# EAGLE design ATmega8U2_Breakout-v11 (EAGLE 5.10)
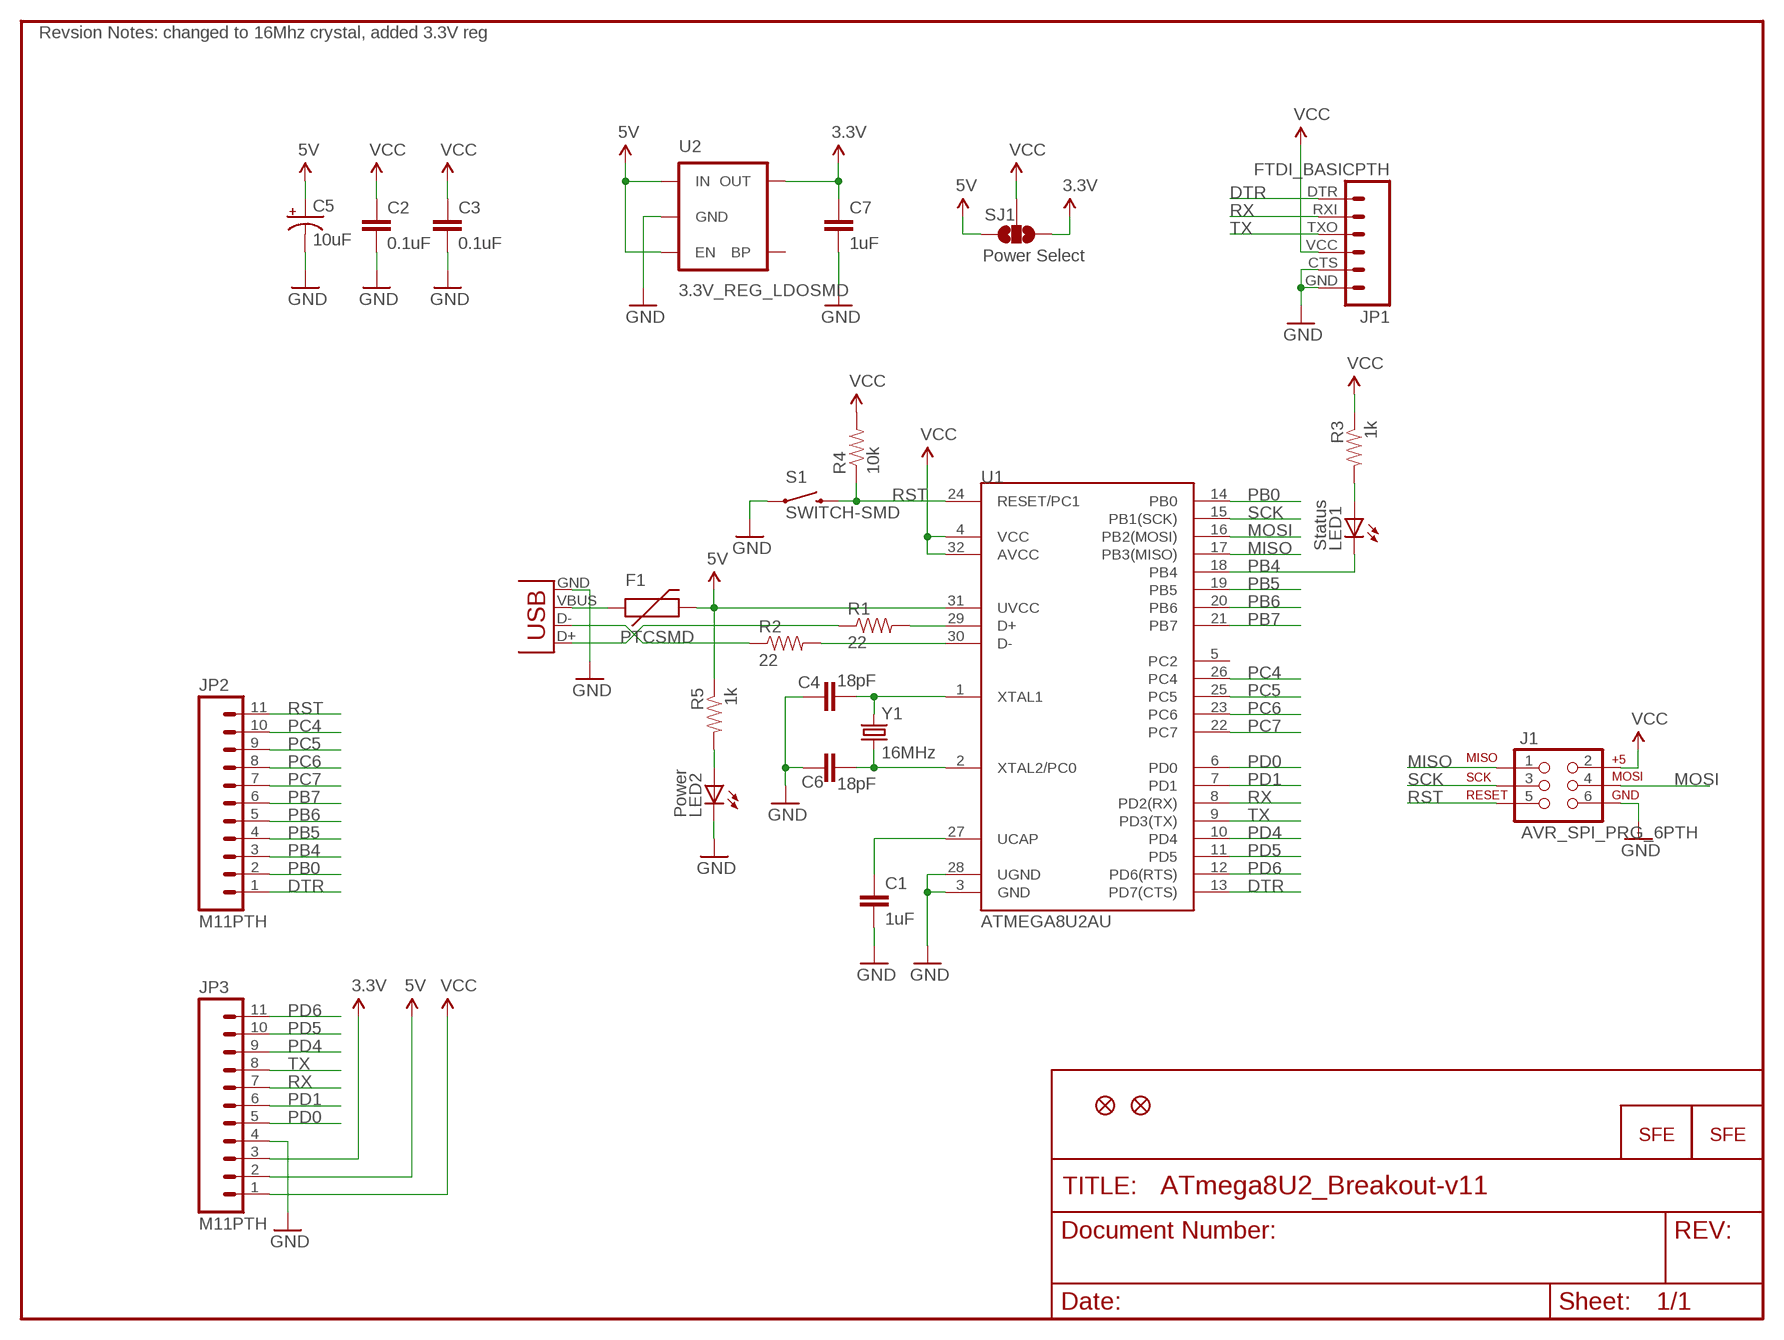
[diagram p0: schematic, sheet 1]

## Parts
C1  1uF  CAP0402-CAP  [0402-CAP]
C2  0.1uF  CAP0402-CAP  [0402-CAP]
C3  0.1uF  CAP0402-CAP  [0402-CAP]
C4  18pF  CAP0402-CAP  [0402-CAP]
C5  10uF  CAP_POL1206  [EIA3216]
C6  18pF  CAP0402-CAP  [0402-CAP]
C7  1uF  CAP0402-CAP  [0402-CAP]
F1  PTCSMD  [PTC-1206]
J1  AVR_SPI_PRG_6PTH  [2X3]
JP1  FTDI_BASICPTH  [FTDI_BASIC]
JP2  M11PTH  [1X11]
JP3  M11PTH  [1X11]
JP4  LOGO-SFENEW  [SFE-NEW-WEBLOGO]
JP5  LOGO-SFESK  [SFE-LOGO-FLAME]
JP6  FIDUCIAL1X2  [FIDUCIAL-1X2]
JP7  FIDUCIAL1X2  [FIDUCIAL-1X2]
LED1  Status  LED0603  [LED-0603]
LED2  Power  LED0603  [LED-0603]
R1  22  RESISTOR0402-RES  [0402-RES]
R2  22  RESISTOR0402-RES  [0402-RES]
R3  1k  RESISTOR0402-RES  [0402-RES]
R4  10k  RESISTOR0402-RES  [0402-RES]
R5  1k  RESISTOR0402-RES  [0402-RES]
S1  SWITCH-SMD  SWITCH-MOMENTARY-2SMD  [TACTILE_SWITCH_SMD]
SJ1  Power Select  SOLDERJUMPER_2WAYPASTE2&3  [SJ_3_PASTE2&3]
U1  ATMEGA8U2AU  [TQFP32-08]
U2  3.3V_REG_LDOSMD  V_REG_LDOSMD  [SOT23-5]
X1  USBSMD  [USB-MINIB]
Y1  16MHz  CRYSTAL5X3  [CRYSTAL-SMD-5X3]

## Nets
3.3V: C7.1 JP3.3 SJ1.1 U2.5(OUT)
5V: C5.A(+) F1.2 JP3.2 R5.1 SJ1.3 U1.31(UVCC) U2.1(IN) U2.3(EN)
DTR: JP1.DTR JP2.1 U1.13(PD7(CTS))
GND: C1.2 C2.2 C3.2 C4.2 C5.C(-) C6.2 C7.2 J1.6 JP1.CTS JP1.GND JP3.4 LED2.C S1.1 U1.3(GND) U1.28(UGND) U2.2(GND) X1.GND
MISO: J1.1 U1.17(PB3(MISO))
MOSI: J1.4 U1.16(PB2(MOSI))
N$1: F1.1 X1.VBUS
N$2: LED2.A R5.2
N$3: R1.2 U1.29(D+)
N$4: R2.2 U1.30(D-)
N$5: R1.1 X1.D+
N$6: R2.1 X1.D-
N$7: LED1.A R3.2
N$8: C4.1 U1.1(XTAL1) Y1.3
N$9: C6.1 U1.2(XTAL2/PC0) Y1.1
N$12: C1.1 U1.27(UCAP)
PB0: JP2.2 U1.14(PB0)
PB4: JP2.3 LED1.C U1.18(PB4)
PB5: JP2.4 U1.19(PB5)
PB6: JP2.5 U1.20(PB6)
PB7: JP2.6 U1.21(PB7)
PC4: JP2.10 U1.26(PC4)
PC5: JP2.9 U1.25(PC5)
PC6: JP2.8 U1.23(PC6)
PC7: JP2.7 U1.22(PC7)
PD0: JP3.5 U1.6(PD0)
PD1: JP3.6 U1.7(PD1)
PD4: JP3.9 U1.10(PD4)
PD5: JP3.10 U1.11(PD5)
PD6: JP3.11 U1.12(PD6(RTS))
RST: J1.5 JP2.11 R4.1 S1.3 U1.24(RESET/PC1)
RX: JP1.RXI JP3.7 U1.8(PD2(RX))
SCK: J1.3 U1.15(PB1(SCK))
TX: JP1.TXO JP3.8 U1.9(PD3(TX))
VCC: C2.1 C3.1 J1.2 JP1.VCC JP3.1 R3.1 R4.2 SJ1.2 U1.4(VCC) U1.32(AVCC)
Unconnected: U1.5(PC2) U2.4(BP)

## Notes on the sheet
- Revsion Notes: changed to 16Mhz crystal, added 3.3V reg

## Library data of the parts
C1-C4 C6 C7 = SparkFun:CAP: Capacitor Standard 0603 ceramic capacitor, and 0.1" leaded capacitor.
C5 = SparkFun:CAP_POL: Capacitor Polarized These are standard SMD and PTH capacitors. Normally 10uF, 47uF, and 100uF in electrolytic and tantalum varieties. Always verify the external diameter of the through hole cap, it varies with capacity, voltage, and manufacturer. The EIA devices should be standard.
F1 = SparkFun:PTC: Resettable Fuse PTC Resettable Fuse. Spark Fun Electronics SKU : COM-08357
J1 = SparkFun:AVR_SPI_PRG_6: AVR ISP 6 Pin This is the reduced ISP connector for AVR programming. Common on Arduino. This footprint will take up less PCB space and can be used with a 10-pin to 6-pin adapter such as SKU: BOB-08508
JP1 = SparkFun:FTDI_BASIC: FTDI Basic: 3.3V and 5V
JP2 JP3 = SparkFun:M11: Header 11 Standard 11-pin 0.1" header. Use with straight break away headers (SKU : PRT-00116), right angle break away headers (PRT-00553), swiss pins (PRT-00743), machine pins (PRT-00117), and female headers (PRT-00115).
JP4 JP5 = SparkFun:LOGO-SFE: Spark Fun Electronics PCB Logo This is the standard Spark Fun Electronics PCB logo.
JP6 JP7 = SparkFun:FIDUCIAL: Fiducial Alignment Points Various fiducial points for machine vision alignment.
LED1 LED2 = SparkFun:LED: LEDs Standard schematic elements and footprints for 5mm, 3mm, 1206, and 0603 sized LEDs. 5mm - Spark Fun Electronics SKU : COM-00529 (and others)
R1-R5 = SparkFun:RESISTOR: Resistor Basic schematic elements and footprints for 0603, 1206, and PTH resistors.
S1 = SparkFun:SWITCH-MOMENTARY-2
SJ1 = SparkFun:SOLDERJUMPER_2WAY: Solder Jumper 2 way solder jumper
U1 = SparkFun:ATMEGA8U2: Atmel 8-bit Microcontroller with 8/16/32K Bystes of ISP Flash and USB Controller. ATmega8U2, ATmega16U2, and ATmega32U2
U2 = SparkFun:V_REG_LDO: Voltage Regulator LDO Standard 150mA LDO voltage regulator in SOT-23 layout. Micrel part MIC5205. BP (by-pass) pin is used to lower output noise with 470pF cap.
X1 = SparkFun:USB: USB Connectors USB-B-PTH is fully proven SKU : PRT-00139 USB-miniB is fully proven SKU : PRT-00587 USB-A-PCB is untested. USB-A-H is throughly reviewed, but untested. Spark Fun Electronics SKU : PRT-00437 USB-B-SMT is throughly reviewed, but untested. Needs silkscreen touching up. USB-A-S has not been used/tested USB-MB-H has not been used/tested
Y1 = SparkFun:CRYSTAL: Crystals Various standard crystals. Proven footprints. Spark Fun Electronics SKU : COM-00534

## Board
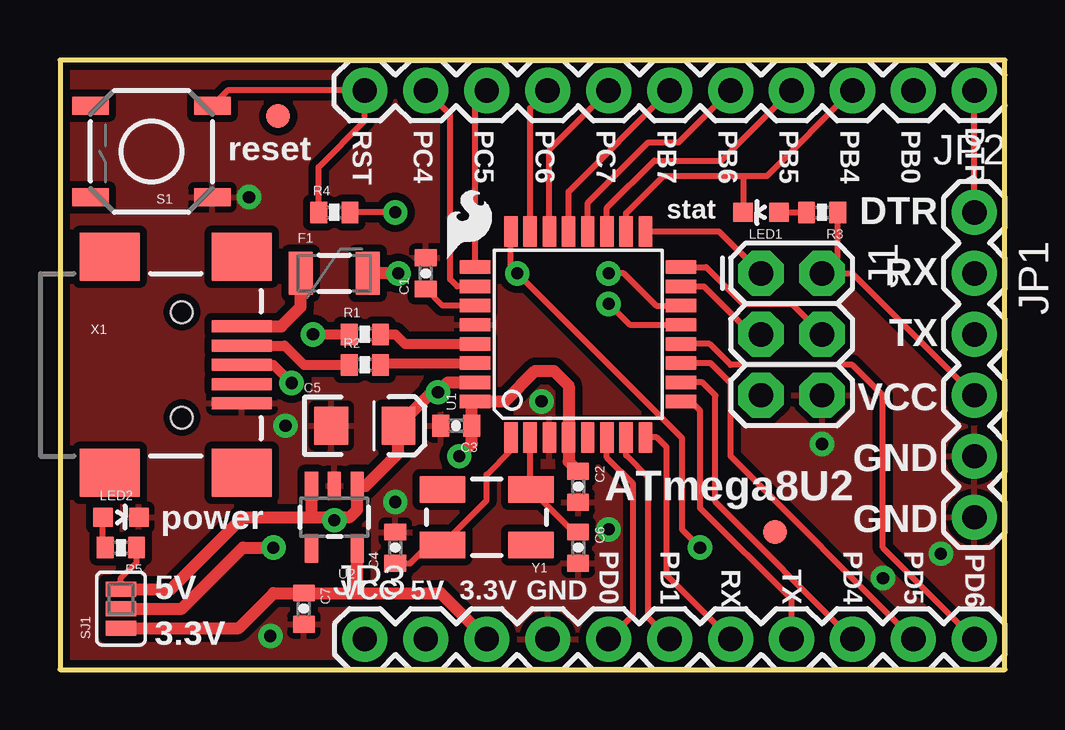
[diagram p1: board, top side]
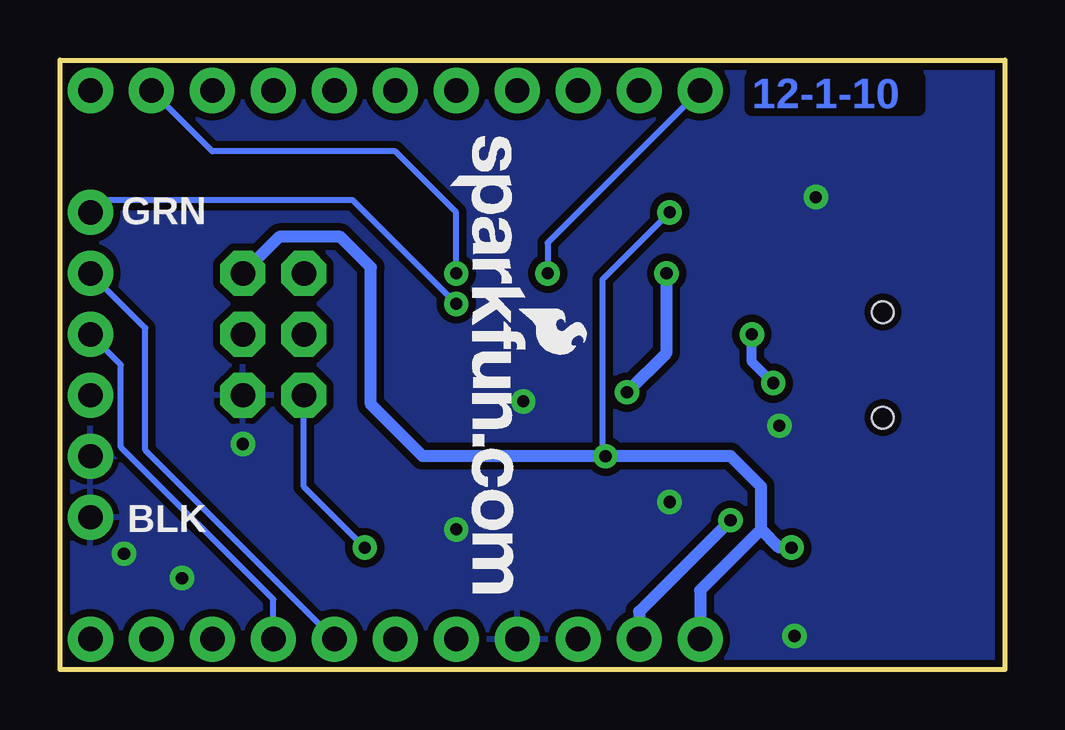
[diagram p2: board, bottom side, seen from below]

Size 39.37 x 25.4 mm. Coordinates in mm from the lower left corner, seen from the top.
Outline: 0,0 39.37,0 39.37,25.4 0,25.4 0,0
Copper layers (1*16): Top 0.035mm / dielectric 1.5mm / Bottom 0.035mm
Design rules "SparkFun": minimum track width 8mil, minimum drill 20mil, track to track 8mil, track to pad 8mil, pad to pad 8mil, via to via 8mil, smd to smd 8mil, copper to edge 8mil, drill to drill 8mil, minimum pad ring 12mil, minimum via ring 10mil, stop-mask expansion 4mil, vias tented up to drill 20mil, thermal gap 10mil

### Footprints (pad centres in the part's own frame; a part is rotated, then mirrored left to right if it is on the bottom)
0402-CAP = smd 0.7 x 0.9: 1 -0.65,0; 2 0.65,0
EIA3216 = smd 1.4 x 1.6: A 1.4,0; C -1.4,0
PTC-1206 = smd 1 x 1.8: 1 -1.4,0; 2 1.4,0
2X3 = drill 1.016 pad 1.88 octagon: 1 0,0; 2 0,2.54; 3 2.54,0; 4 2.54,2.54; 5 5.08,0; 6 5.08,2.54
FTDI_BASIC = drill 1.016 pad 1.88 round: CTS 10.16,0; DTR 0,0; GND 12.7,0; RXI 2.54,0; TXO 5.08,0; VCC 7.62,0
1X11 = drill 1.016 pad 1.88 round: 1 0,0; 2 2.54,0; 3 5.08,0; 4 7.62,0; 5 10.16,0; 6 12.7,0; 7 15.24,0; 8 17.78,0; 9 20.32,0; 10 22.86,0; 11 25.4,0
FIDUCIAL-1X2 = smd 1 x 1: 1 0,0
LED-0603 = smd 0.8 x 0.8: A 0,-0.75; C 0,0.75
0402-RES = smd 0.7 x 0.9: 1 -0.65,0; 2 0.65,0
TACTILE_SWITCH_SMD = smd 1.524 x 0.762: 1 -2.54,1.905; 2 2.54,1.905; 3 -2.54,-1.905; 4 2.54,-1.905
SJ_3_PASTE2&3 = smd 0.635 x 1.27: 1 -0.813,0; 2 0,0; 3 0.813,0
TQFP32-08 = smd 1.27 x 0.559: 1 -4.293,2.8; 2 -4.293,2; 3 -4.293,1.2; 4 -4.293,0.4; 5 -4.293,-0.4; 6 -4.293,-1.2; 7 -4.293,-2; 8 -4.293,-2.8; 17 4.293,-2.8; 18 4.293,-2; 19 4.293,-1.2; 20 4.293,-0.4; 21 4.293,0.4; 22 4.293,1.2; 23 4.293,2; 24 4.293,2.8 | smd 0.559 x 1.27: 9 -2.8,-4.293; 10 -2,-4.293; 11 -1.2,-4.293; 12 -0.4,-4.293; 13 0.4,-4.293; 14 1.2,-4.293; 15 2,-4.293; 16 2.8,-4.293; 25 2.8,4.293; 26 2,4.293; 27 1.2,4.293; 28 0.4,4.293; 29 -0.4,4.293; 30 -1.2,4.293; 31 -2,4.293; 32 -2.8,4.293
SOT23-5 = smd 0.55 x 1.2: 1 -0.95,-1.3; 2 0,-1.3; 3 0.95,-1.3; 4 0.95,1.3; 5 -0.95,1.3
USB-MINIB = smd 2.5 x 0.5: D+ 2.5,0; D- 2.5,0.8; GND 2.5,-1.6; ID 2.5,-0.8; VBUS 2.5,1.6 | smd 2.5 x 2: MTN1 -3,4.5; MTN2 2.5,4.5; MTN3 -3,-4.5; MTN4 2.5,-4.5 | hole 0.9: 0,2.2; 0,-2.2
CRYSTAL-SMD-5X3 = smd 1.9 x 1.1: 1 -1.85,-1.15; 2 1.85,-1.15; 3 1.85,1.15; 4 -1.85,1.15

### Placement (x,y rotation side)
C1  15.24,16.51 90 top
C2  21.59,7.62 270 top
C3  16.51,10.16 180 top
C4  13.97,5.08 90 top
C5  12.7,10.16 0 top
C6  21.59,5.08 270 top
C7  10.16,2.54 270 top
F1  11.43,16.51 0 top
J1  29.21,16.51 270 top
JP1  38.1,19.05 270 top
JP2  38.1,24.13 180 top
JP3  12.7,1.27 0 top
JP4  23.11,22.23 270 bottom
JP5  16.13,17.14 0 top
JP6  9.09,23.06 0 top
JP7  29.79,5.74 0 top
LED1  29.21,19.05 90 top
LED2  2.54,6.35 270 top
R1  12.7,13.97 0 top
R2  12.7,12.7 0 top
R3  31.75,19.05 180 top
R4  11.43,19.05 0 top
R5  2.54,5.08 180 top
S1  3.81,21.59 180 top
SJ1  2.54,2.54 90 top
U1  21.59,13.97 90 top
U2  11.43,6.35 180 top
X1  5.08,12.7 0 top
Y1  17.78,6.35 180 top

### Tracks (layer width: path | path; a pad name or v marks a point on that pad's centre or on a via)
3.3V
  Top 0.508: SJ1.1 7.44,1.73 8.9,3.19 C7.1 12.32,3.19 | 12.32,3.19 15.86,3.19 JP3.3 | U2.5 12.38,3.25 12.32,3.19
5V  (via drill 0.51)
  Top 0.254: R5.1 3.19,4.46 2.54,3.81 SJ1.3
  Top 0.508: U1.31 16.16,11.97 v15.75,11.56 15.5,11.56 C5.A 14.1,9.02 12.73,7.65 U2.1 12.38,6.67 12.06,6.35 11.56,6.35 v11.43,6.22 11.3,6.35 10.54,6.35 | v14.1,16.51 F1.2 | SJ1.3 4.62,3.35 7.62,6.35 10.54,6.35 | U2.3 10.48,6.41 10.54,6.35
  Bottom 0.508: v14.1,16.51 14.1,13.21 v15.75,11.56 | JP3.2 15.24,2.41 v11.43,6.22
DTR  (via drill 0.51)
  Top 0.254: JP1.DTR JP2.1 | U1.13 23.73,14.37 v22.86,15.24
  Bottom 0.254: v22.86,15.24 27.18,19.56 37.59,19.56 JP1.DTR
GND  (via drill 0.51)
  other vias: 8.76,1.4 13.97,6.99 20.07,11.18 22.86,5.84 31.75,9.4 36.7,4.83 34.29,3.81 9.4,10.16 7.87,19.68
  pour Top (isolate 0.305): 0,25.4 0,0 39.37,0 39.37,25.4
  pour Bottom (isolate 0.305): 0,25.4 0,0 39.37,0 39.37,25.4
MISO
  Top 0.254: U1.17 27.46,18.26 J1.1
MOSI
  Top 0.254: U1.16 26.92,16.77 28.45,15.24 30.48,15.24 J1.4
N$1
  Top 0.508: X1.VBUS 9.22,14.3 10.03,15.11 F1.1
N$2
  Top 0.254: LED2.A 1.79,5.18 R5.2
N$3
  Top 0.406: U1.29 14.37,13.57 13.97,13.97 R1.2
N$4
  Top 0.406: U1.30 13.42,12.77 R2.2
N$5  (via drill 0.51)
  Top 0.406: X1.D+ 8.89,12.7 v9.65,11.94 | v10.54,13.97 R1.1
  Bottom 0.406: v10.54,13.97 10.54,12.83 v9.65,11.94
N$6
  Top 0.406: R2.1 10.16,12.7 9.36,13.5 X1.D-
N$7
  Top 0.254: LED1.A R3.2
N$8
  Top 0.254: C4.1 14.59,4.43 15.24,5.08 15.81,5.08 Y1.3 17.78,7.05 17.78,8.13 18.79,9.14 U1.1
N$9
  Top 0.254: U1.2 19.59,7.54 Y1.1 21.4,5.73 C6.1
N$12
  Top 0.254: U1.27 15.93,15.17 C1.1
PB0  (via drill 0.51)
  Top 0.254: U1.14 24.84,15.17 23.5,16.51 v22.86,16.51
  Bottom 0.254: JP2.2 33.02,21.59 25.4,21.59 22.86,19.05 v22.86,16.51
PB4
  Top 0.254: U1.18 23.59,19.02 25.15,20.57 28.57,20.57 | 28.57,20.57 29.46,20.57 JP2.3 | 28.57,20.57 28.56,20.56 28.46,20.46 LED1.C
PB5
  Top 0.254: U1.19 22.79,19.23 24.77,21.21 27.56,21.21 JP2.4
PB6
  Top 0.254: U1.20 21.99,19.45 24.51,21.97 25.78,21.97 JP2.5
PB7
  Top 0.254: U1.21 21.19,19.92 JP2.6
PC4
  Top 0.254: U1.26 16.54,15.97 16.26,16.26 16.26,23.11 JP2.10
PC5
  Top 0.254: U1.25 17.3,23.65 JP2.9
PC6
  Top 0.254: U1.23 19.59,23.4 JP2.8
PC7
  Top 0.254: U1.22 20.39,21.66 JP2.7
PD0
  Top 0.254: U1.6 22.79,8.83 23.88,7.75 23.88,2.29 JP3.5
PD1
  Top 0.254: JP3.6 24.51,2.16 24.51,8 23.59,8.92 U1.7
PD4
  Top 0.254: U1.10 26.77,11.97 27.3,11.43 27.3,6.99 JP3.9
PD5
  Top 0.254: U1.11 27.11,12.77 27.94,11.94 27.94,8.89 JP3.10
PD6
  Top 0.254: U1.12 27.07,13.57 27.94,12.7 33.02,12.7 34.29,11.43 34.29,5.08 JP3.11
RST  (via drill 0.51)
  Top 0.254: S1.3 6.99,24.13 JP2.11 12.7,22.86 10.78,20.94 R4.1 | U1.24 18.79,16.77 v19.05,16.51 25.91,9.65 25.91,5.84 v26.67,5.08
  Bottom 0.254: v19.05,16.51 19.05,17.78 JP2.11 | J1.5 29.21,7.62 v26.67,5.08
RX
  Top 0.254: U1.8 24.87,9.68 25.27,9.27 25.27,3.94 JP3.7
  Bottom 0.254: JP1.RXI 35.81,14.22 35.81,9.14 JP3.7
SCK
  Top 0.254: U1.15 26.83,15.97 28.83,13.97 J1.3
TX
  Top 0.254: U1.9 26.28,11.17 26.29,11.18 26.67,10.79 26.67,6.73 30.48,2.92 JP3.8
  Bottom 0.254: JP1.TXO 36.83,12.7 36.83,9.27 30.48,2.92 JP3.8
VCC  (via drill 0.51)
  Top 0.254: v13.97,19.05 R4.2 | JP1.VCC 33.02,16.51 J1.2 32.4,17.16 R3.1
  Top 0.508: v16.64,8.89 17.16,9.41 C3.1 17.16,11.03 U1.32 18.54,11.18 19.81,12.45 20.57,12.45 21.19,11.83 U1.4 21.19,8.67 C2.1 | SJ1.2 5.08,2.54 7.62,5.08 v8.89,5.08
  Bottom 0.254: v13.97,19.05 16.76,16.26 16.76,9.02 v16.64,8.89
  Bottom 0.508: 10.16,5.84 10.16,7.62 11.43,8.89 v16.64,8.89 24.26,8.89 26.42,11.05 26.42,16.76 27.69,18.03 30.23,18.03 J1.2 | 10.16,5.84 12.7,3.3 JP3.1 | v8.89,5.08 9.4,5.08 10.16,5.84

### Text on the board
Bottom: 12-1-10
tPlace: DTR | RST | PC4 | PC5 | PC6 | PC7 | PB7 | PB6 | PB5 | PB4 | PB0 | reset | DTR | stat | RX | TX | VCC | GND | ATmega8U2 | GND | power | PD0 | PD1 | PD4 | PD5 | PD6 | RX | TX | 5V | VCC | 5V | 3.3V | GND | 3.3V
bPlace: GRN | BLK